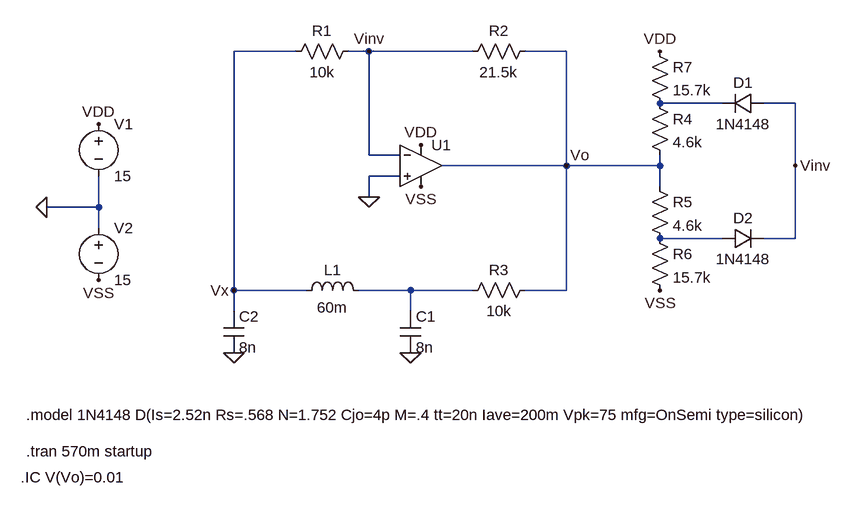
[diagram p0: schematic Q2.asc]
Q2.asc, the LTspice schematic file:
Version 4
SHEET 1 1384 1056
WIRE 128 112 32 112
WIRE 240 112 208 112
WIRE 400 112 240 112
WIRE 544 112 480 112
WIRE 784 192 688 192
WIRE 896 192 848 192
WIRE 240 272 240 112
WIRE 288 272 240 272
WIRE 544 288 544 112
WIRE 544 288 352 288
WIRE 688 288 688 272
WIRE 688 288 544 288
WIRE 896 288 896 192
WIRE 288 304 240 304
WIRE 688 320 688 288
WIRE 240 336 240 304
WIRE -176 352 -176 304
WIRE -176 352 -256 352
WIRE -176 384 -176 352
WIRE 784 400 688 400
WIRE 896 400 896 288
WIRE 896 400 848 400
WIRE 32 480 32 112
WIRE 144 480 32 480
WIRE 304 480 224 480
WIRE 400 480 304 480
WIRE 544 480 544 288
WIRE 544 480 480 480
WIRE 32 512 32 480
WIRE 304 512 304 480
FLAG 240 336 0
FLAG 32 576 0
FLAG -256 352 0
FLAG -176 224 VDD
FLAG -176 464 VSS
FLAG 320 256 VDD
FLAG 320 320 VSS
FLAG 304 576 0
FLAG 544 288 Vo
FLAG 688 112 VDD
FLAG 688 480 VSS
FLAG 240 112 Vinv
FLAG 32 480 Vx
FLAG 896 288 Vinv
SYMBOL res 224 96 R90
WINDOW 0 0 56 VBottom 2
WINDOW 3 32 56 VTop 2
SYMATTR InstName R1
SYMATTR Value 10k
SYMBOL res 496 96 R90
WINDOW 0 0 56 VBottom 2
WINDOW 3 32 56 VTop 2
SYMATTR InstName R2
SYMATTR Value 21.5k
SYMBOL res 496 464 R90
WINDOW 0 0 56 VBottom 2
WINDOW 3 32 56 VTop 2
SYMATTR InstName R3
SYMATTR Value 10k
SYMBOL ind 128 496 R270
WINDOW 0 32 56 VTop 2
WINDOW 3 5 56 VBottom 2
SYMATTR InstName L1
SYMATTR Value 60m
SYMBOL cap 16 512 R0
SYMATTR InstName C2
SYMATTR Value 8n
SYMBOL voltage -176 208 R0
WINDOW 123 0 0 Left 0
WINDOW 39 0 0 Left 0
SYMATTR InstName V1
SYMATTR Value 15
SYMBOL voltage -176 368 R0
WINDOW 123 0 0 Left 0
WINDOW 39 0 0 Left 0
SYMATTR InstName V2
SYMATTR Value 15
SYMBOL OpAmps\\UniversalOpamp2 320 288 R0
SYMATTR InstName U1
SYMATTR SpiceLine Ilimit=25m Rail=1.5 Vos=0 Phimargin=45
SYMBOL cap 288 512 R0
SYMATTR InstName C1
SYMATTR Value 8n
SYMBOL res 672 176 R0
SYMATTR InstName R4
SYMATTR Value 4.6k
SYMBOL res 672 304 R0
SYMATTR InstName R5
SYMATTR Value 4.6k
SYMBOL res 672 384 R0
SYMATTR InstName R6
SYMATTR Value 15.7k
SYMBOL res 672 96 R0
SYMATTR InstName R7
SYMATTR Value 15.7k
SYMBOL diode 848 208 M270
WINDOW 0 32 32 VTop 2
WINDOW 3 0 32 VBottom 2
SYMATTR InstName D1
SYMATTR Value 1N4148
SYMBOL diode 784 416 R270
WINDOW 0 32 32 VTop 2
WINDOW 3 0 32 VBottom 2
SYMATTR InstName D2
SYMATTR Value 1N4148
TEXT -288 728 Left 2 !.tran 570m startup
TEXT -296 768 Left 2 !.IC V(Vo)=0.01
TEXT -288 672 Left 2 !.model 1N4148 D(Is=2.52n Rs=.568 N=1.752 Cjo=4p M=.4 tt=20n Iave=200m Vpk=75 mfg=OnSemi type=silicon)

The netlist it stands for:
* Q2.asc
R1 Vinv Vx 10k
R2 Vo Vinv 21.5k
R3 Vo N003 10k
L1 Vx N003 60m
C2 Vx 0 8n
V1 VDD 0 15
V2 0 VSS 15
XU1 0 Vinv VDD VSS Vo level.2 Avol=1Meg GBW=10Meg Slew=10Meg Ilimit=25m Rail=1.5 Vos=0 Phimargin=45 en=0 enk=0 in=0 ink=0 Rin=500Meg  ; pins IN+ IN- V+ V- OUT
C1 N003 0 8n
R4 N001 Vo 4.6k
R5 Vo N002 4.6k
R6 N002 VSS 15.7k
R7 VDD N001 15.7k
D1 Vinv N001 1N4148
D2 N002 Vinv 1N4148
.model D D
.lib standard.dio
.tran 570m startup
.IC V(Vo)=0.01
.model 1N4148 D(Is=2.52n Rs=.568 N=1.752 Cjo=4p M=.4 tt=20n Iave=200m Vpk=75 mfg=OnSemi type=silicon)
.lib UniversalOpamps2.sub
.backanno
.end